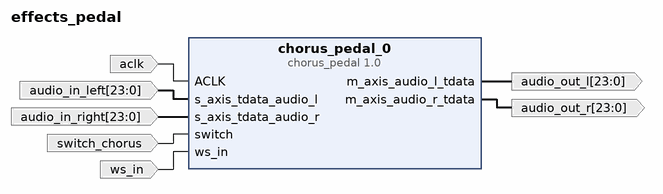
[diagram p0: block diagram of the top level]
# Vivado block design effects_pedal, xc7a100tcsg324-1, Vivado 2022.1
create_bd_design effects_pedal

create_bd_port -dir I -type clk aclk
set_property -dict {CONFIG.FREQ_HZ 11289000} [get_bd_ports aclk]
create_bd_port -dir I -type clk ws_in
set_property -dict {CONFIG.FREQ_HZ 44000} [get_bd_ports ws_in]
create_bd_port -dir I -from 23 -to 0 audio_in_left
create_bd_port -dir I -from 23 -to 0 audio_in_right
create_bd_port -dir O -from 23 -to 0 audio_out_l
create_bd_port -dir O -from 23 -to 0 audio_out_r
create_bd_port -dir I switch_chorus

create_bd_cell -type ip -vlnv xilinx.com:user:chorus_pedal:1.0 chorus_pedal_0

# ---- connections ----

connect_bd_net [get_bd_ports aclk] [get_bd_pins chorus_pedal_0/ACLK]
connect_bd_net [get_bd_ports audio_in_left] [get_bd_pins chorus_pedal_0/s_axis_tdata_audio_l]
connect_bd_net [get_bd_ports audio_in_right] [get_bd_pins chorus_pedal_0/s_axis_tdata_audio_r]
connect_bd_net [get_bd_pins chorus_pedal_0/m_axis_audio_l_tdata] [get_bd_ports audio_out_l]
connect_bd_net [get_bd_pins chorus_pedal_0/m_axis_audio_r_tdata] [get_bd_ports audio_out_r]
connect_bd_net [get_bd_ports switch_chorus] [get_bd_pins chorus_pedal_0/switch]
connect_bd_net [get_bd_ports ws_in] [get_bd_pins chorus_pedal_0/ws_in]

validate_bd_design
save_bd_design
